# EAGLE design OR timing pulse (EAGLE 9.6.2)
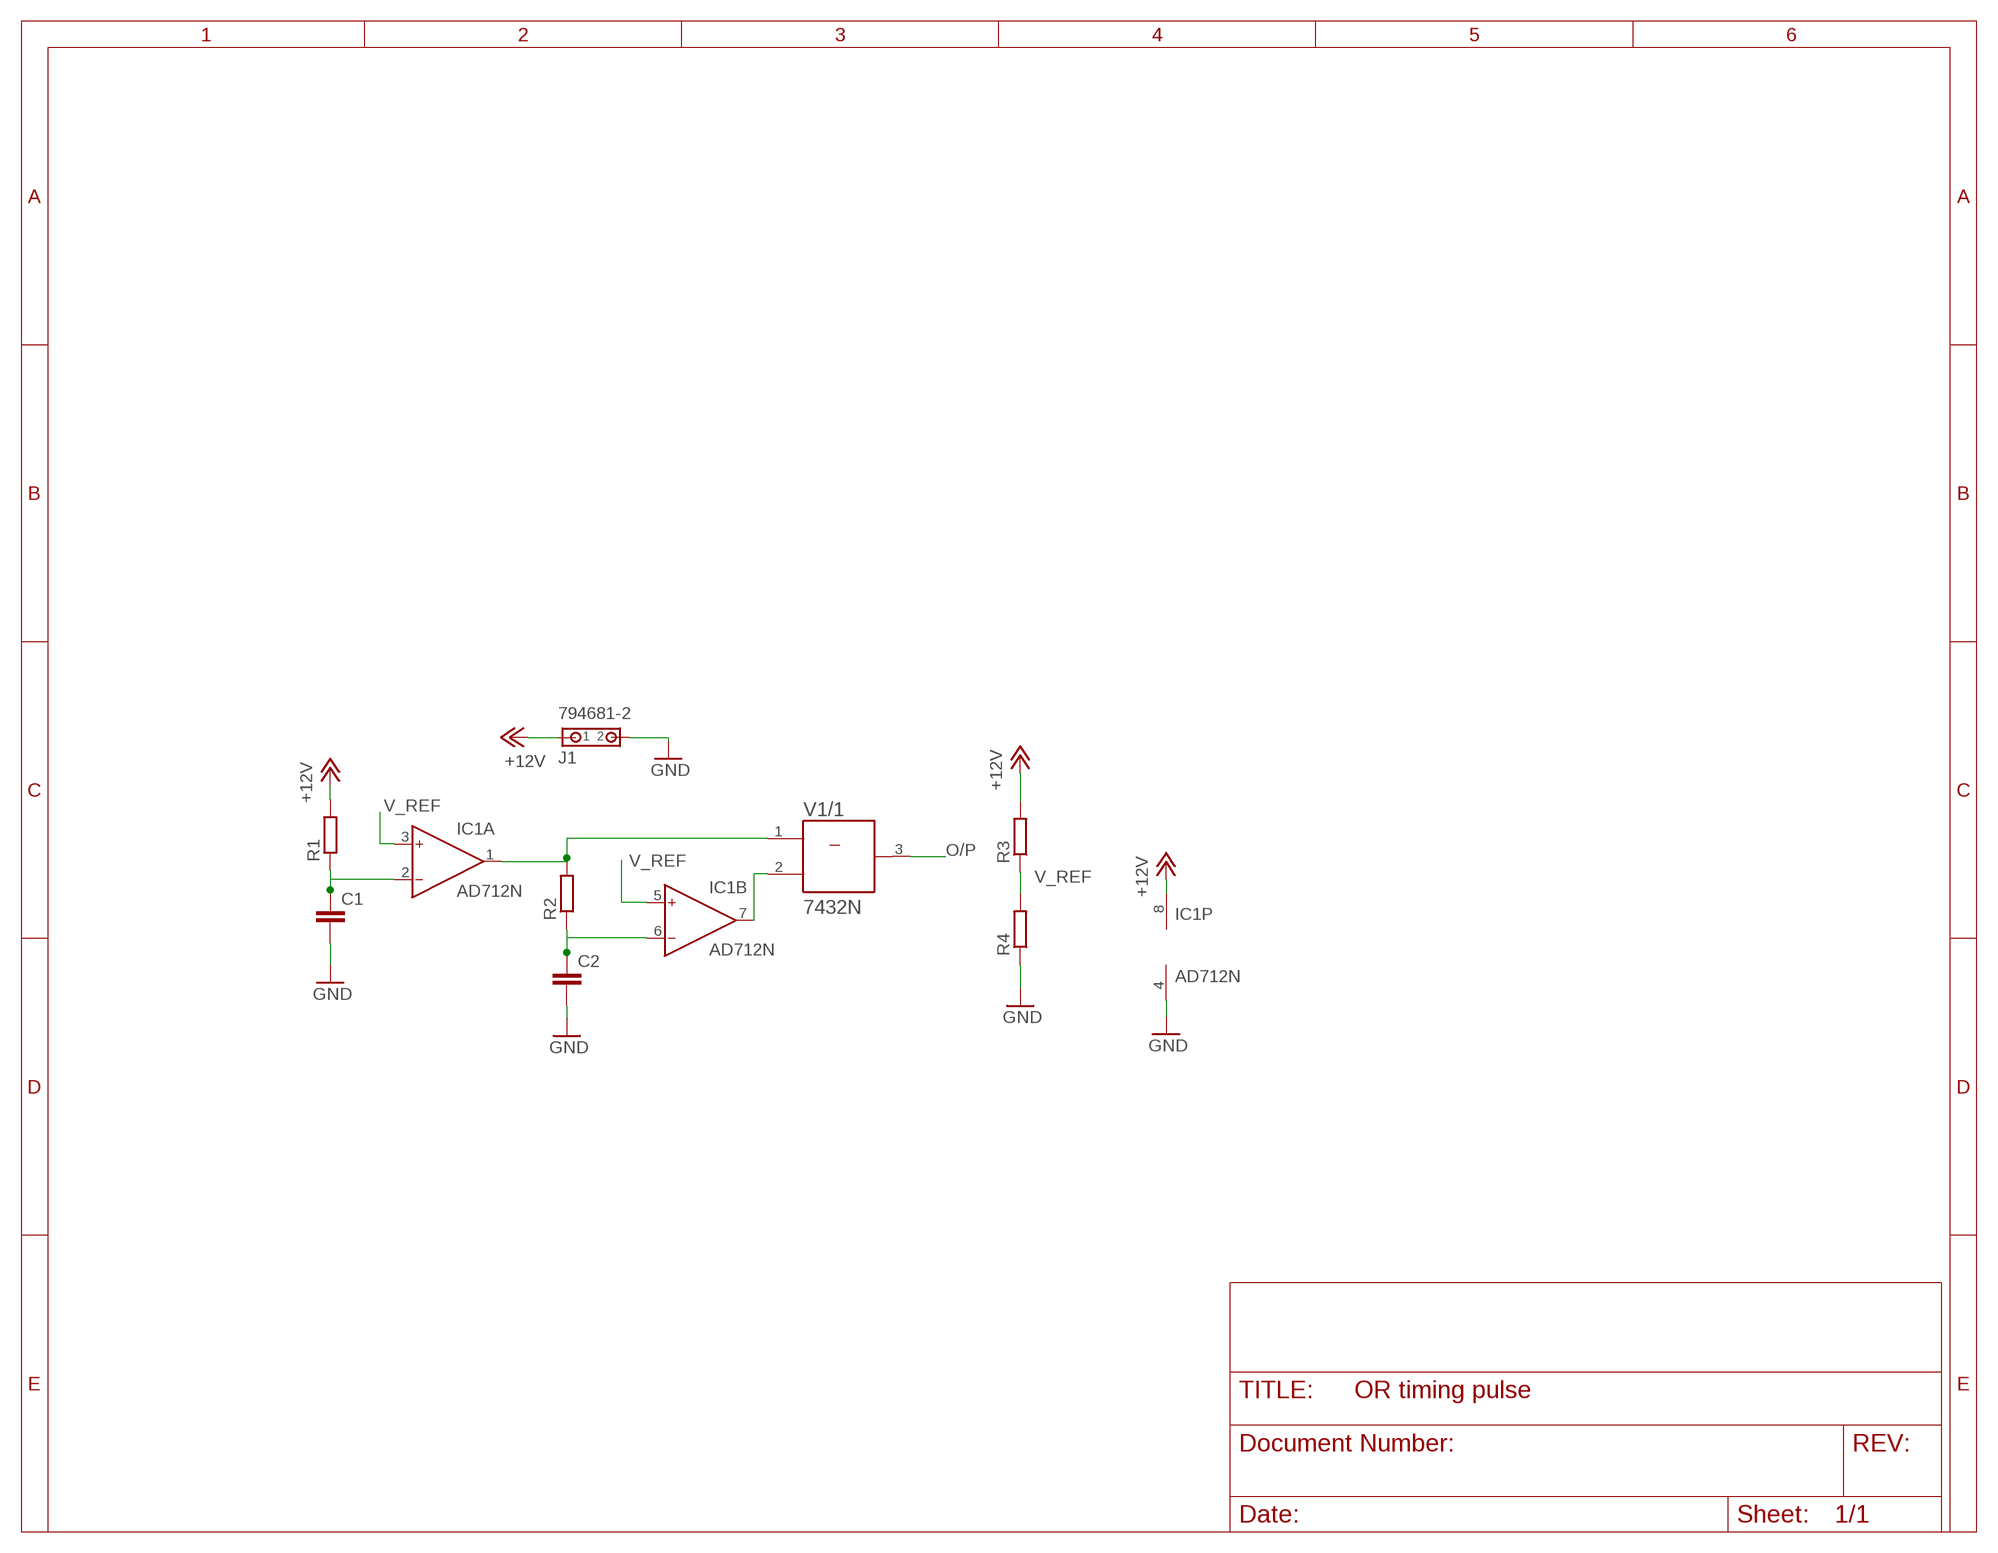
[diagram p0: schematic, sheet 1]

## Parts
C1  C-EUC0805  [C0805]
C2  C-EUC0805  [C0805]
IC1  AD712N  [DIL08]
J1  794681-2  [794681-2]
R1  R-EU_R0805  [R0805]
R2  R-EU_R0805  [R0805]
R3  R-EU_R0805  [R0805]
R4  R-EU_R0805  [R0805]
V1  7432N  [DIL14]

## Nets
+12V: IC1.8(P:V+) J1.1 R1.2 R3.2
GND: C1.2 C2.2 IC1.4(P:V-) J1.2 R4.1
N$1: C1.1 IC1.2(A:IN-) R1.1
N$2: C2.1 IC1.6(B:IN-) R2.1
N$3: IC1.1(A:OUT) R2.2 V1.1(/1:A)
N$4: IC1.7(B:OUT) V1.2(/1:B)
O/P: V1.3(/1:Y)
V_REF: IC1.3(A:IN+) IC1.5(B:IN+) R3.1 R4.2
Unconnected: V1.4(/2:A) V1.5(/2:B) V1.6(/2:Y) V1.8(/3:Y) V1.9(/3:A) V1.10(/3:B) V1.11(/4:Y) V1.12(/4:A) V1.13(/4:B)

## Power pins joined to a net without a drawn wire
+UB: V1.14(/+UB:+UB)
-UB: V1.7(/-UB:-UB)

## Library data of the parts
C1 C2 = rcl:C-EU: CAPACITOR, European symbol; SPICEPREFIX: C
IC1 = analog-devices:AD712: Dual Precision, Low Cost, High Speed BiFET Op Amp Source: http://www.analog.com/static/imported-files/data_sheets/AD712.pdf; MF: ALTERA CORPORATION; MPN: AD712JNZ; OC_FARNELL: 9604898; OC_NEWARK: 59K4554
J1 = con-amp:794681-2: Micro MATE-N-LOK Connectors grid 1.5mm Dual Row Through Hole Vertical Metal Through Hole Holddowns Source: ENG_CD_794681_E.pdf
R1-R4 = rcl:R-EU_: RESISTOR, European symbol; SPICEPREFIX: R
V1 = 74ttl-din:74*32: Quad 2-input OR gate

## Board
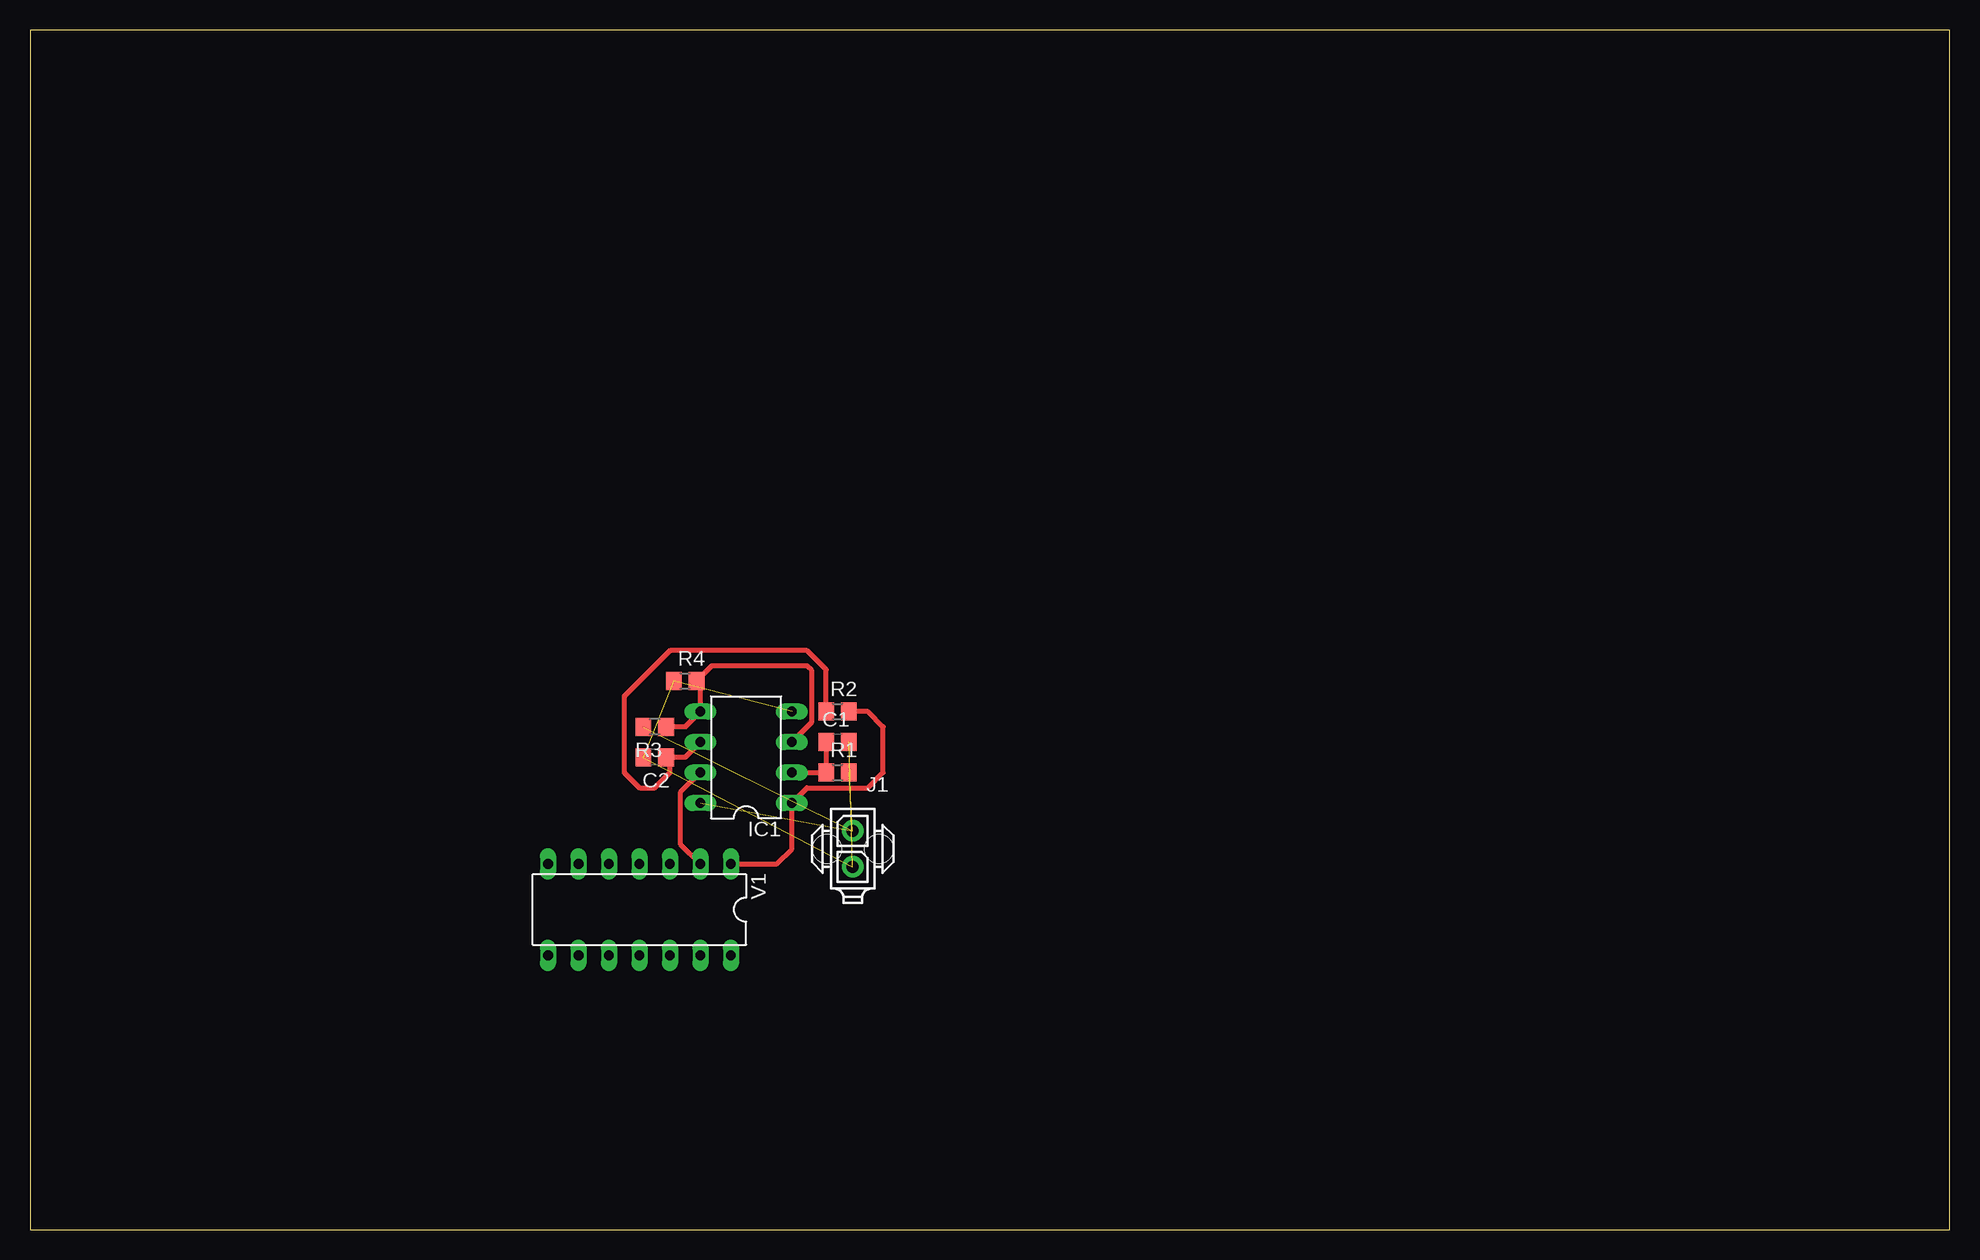
[diagram p1: board, top side]

Size 160 x 100 mm. Coordinates in mm from the lower left corner, seen from the top.
Outline: 0,0 160,0 160,100 0,100 0,0
Copper layers (1*16): Top 0.035mm / dielectric 1.5mm / Bottom 0.035mm
Design rules "default": minimum track width 6mil, minimum drill 0.35mm, track to track 6mil, track to pad 6mil, pad to pad 6mil, via to via 6mil, smd to smd 6mil, copper to edge 40mil, drill to drill 6mil, minimum pad ring 10mil, minimum via ring 8mil, stop-mask expansion 4mil, vias tented up to drill 0mil, thermal gap 10mil

### Footprints (pad centres in the part's own frame; a part is rotated, then mirrored left to right if it is on the bottom)
C0805 = smd 1.3 x 1.5: 1 -0.95,0; 2 0.95,0
DIL08 = drill 0.813 long: 1 -3.81,-3.81; 2 -1.27,-3.81; 3 1.27,-3.81; 4 3.81,-3.81; 5 3.81,3.81; 6 1.27,3.81; 7 -1.27,3.81; 8 -3.81,3.81
794681-2 = drill 1 pad 1.778: 1 0,-1.5; 2 0,1.5 | hole 2.4: 2.13,0; -2.17,0
R0805 = smd 1.3 x 1.5: 1 -0.95,0; 2 0.95,0
DIL14 = drill 0.813 long: 1 -7.62,-3.81; 2 -5.08,-3.81; 3 -2.54,-3.81; 4 0,-3.81; 5 2.54,-3.81; 6 5.08,-3.81; 7 7.62,-3.81; 8 7.62,3.81; 9 5.08,3.81; 10 2.54,3.81; 11 0,3.81; 12 -2.54,3.81; 13 -5.08,3.81; 14 -7.62,3.81

### Placement (x,y rotation side)
C1  67.31,40.64 0 top
C2  52.07,39.37 180 top
IC1  59.69,39.37 90 top
J1  68.58,31.75 180 top
R1  67.31,38.1 0 top
R2  67.31,43.18 0 top
R3  52.07,41.91 180 top
R4  54.61,45.72 0 top
V1  50.8,26.67 180 top

### Tracks (layer width: path | path; a pad name or v marks a point on that pad's centre or on a via)
+12V  (3 unrouted)
GND  (4 unrouted)
N$1
  Top 0.406: IC1.2 R1.1 C1.1
N$2
  Top 0.406: IC1.6 54.61,39.37 C2.1 53.34,39.05 53.34,38.1 52.07,36.83 50.8,36.83 49.53,38.1 49.53,44.45 53.34,48.26 64.77,48.26 66.36,46.67 R2.1
N$3
  Top 0.406: V1.1 62.23,30.48 63.5,31.75 IC1.1 64.77,36.83 69.85,36.83 71.12,38.1 71.12,41.91 69.85,43.18 R2.2
N$4
  Top 0.406: IC1.7 54.2,36.42 54.2,32.16 V1.2
V_REF
  Top 0.406: R3.1 54.61,41.91 IC1.5 55.88,45.4 R4.2 56.83,46.99 64.77,46.99 65.18,46.58 65.18,42.32 IC1.3